# Altium schematic sheet VidRayCurrentMonitor.SchDoc
size A
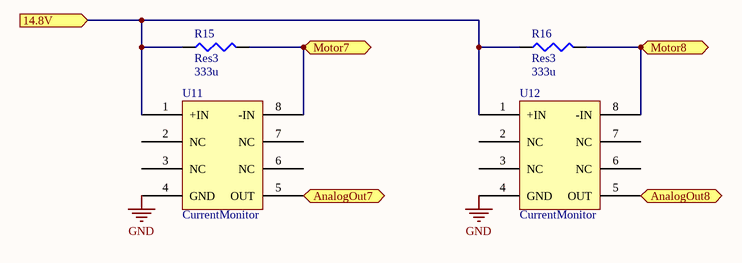
[diagram p0: VidRayCurrentMonitor.SchDoc]

## Parts
R15  Res3  value 333u  [Resistor03mOhm]
R16  Res3  value 333u  [Resistor03mOhm]
U11  CurrentMonitor  [AD8217]
U12  CurrentMonitor  [AD8217]

## Ports
14.8V (in), AnalogOut7 (out), AnalogOut8 (out), Motor7 (out), Motor8 (out)

## Nets
GND: U11.4(GND) U12.4(GND)
14.8V: R15.1 R16.1 U11.1(+IN) U12.1(+IN) ; port 14.8V
AnalogOut7: U11.5(OUT) ; port AnalogOut7
AnalogOut8: U12.5(OUT) ; port AnalogOut8
Motor7: R15.2 U11.8(-IN) ; port Motor7
Motor8: R16.2 U12.8(-IN) ; port Motor8

Not connected (* = marked no-connect by the designer): U11 2(NC) 3(NC) 6(NC) 7(NC); U12 2(NC) 3(NC) 6(NC) 7(NC)

## Library data of the parts
R15 R16 = Res3: Resistor; Published: 8-Jun-2000; LatestRevisionDate: 29-May-2009; LatestRevisionNote: IPC-7351 Footprint Added.; PackageReference: J1-0603; Publisher: Altium Limited; PackageDescription: Chip Resistor
U11 U12 = AD8217